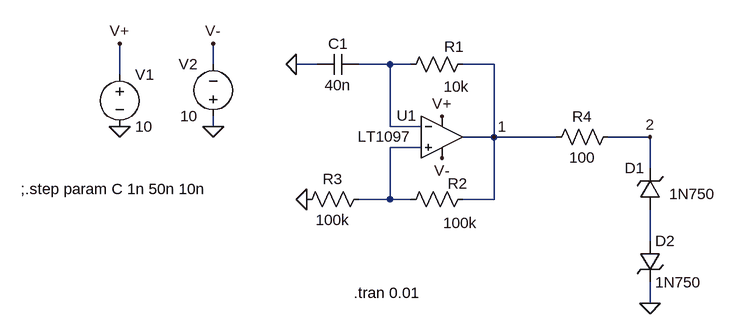
[diagram p0: schematic Ask1.asc]
Ask1.asc, the LTspice schematic file:
Version 4
SHEET 1 880 680
WIRE -48 -96 -48 -128
WIRE 112 -96 80 -96
WIRE 224 -96 176 -96
WIRE 256 -96 224 -96
WIRE 384 -96 336 -96
WIRE -192 -80 -192 -128
WIRE -48 0 -48 -16
WIRE 224 0 224 -96
WIRE 272 0 224 0
WIRE 384 16 384 -96
WIRE 384 16 336 16
WIRE 480 16 384 16
WIRE 624 16 560 16
WIRE 272 32 224 32
WIRE 624 64 624 16
WIRE 224 112 224 32
WIRE 224 112 176 112
WIRE 256 112 224 112
WIRE 384 112 384 16
WIRE 384 112 336 112
WIRE 624 176 624 128
WIRE 624 272 624 240
FLAG 80 -96 0
FLAG -192 0 0
FLAG -192 -128 V+
FLAG 304 -16 V+
FLAG -48 0 0
FLAG -48 -128 V-
FLAG 304 48 V-
FLAG 96 112 0
FLAG 384 16 1
FLAG 624 16 2
FLAG 624 272 0
SYMBOL cap 176 -112 R90
WINDOW 0 0 32 VBottom 2
WINDOW 3 32 32 VTop 2
SYMATTR InstName C1
SYMATTR Value 40n
SYMBOL res 352 -112 R90
WINDOW 0 4 29 VBottom 2
WINDOW 3 35 26 VTop 2
SYMATTR InstName R1
SYMATTR Value 10k
SYMBOL OpAmps\\LT1097 304 -48 R0
WINDOW 0 -70 31 Left 2
WINDOW 3 -130 63 Left 2
SYMATTR InstName U1
SYMBOL res 192 96 R90
WINDOW 0 0 56 VBottom 2
WINDOW 3 32 56 VTop 2
SYMATTR InstName R3
SYMATTR Value 100k
SYMBOL res 352 96 R90
WINDOW 0 7 24 VBottom 2
WINDOW 3 37 20 VTop 2
SYMATTR InstName R2
SYMATTR Value 100k
SYMBOL voltage -192 -96 R0
SYMATTR InstName V1
SYMATTR Value 10
SYMBOL voltage -48 0 R180
WINDOW 0 24 96 Left 2
WINDOW 3 24 16 Left 2
SYMATTR InstName V2
SYMATTR Value 10
SYMBOL res 576 0 R90
WINDOW 0 0 56 VBottom 2
WINDOW 3 32 56 VTop 2
SYMATTR InstName R4
SYMATTR Value 100
SYMBOL zener 640 128 R180
WINDOW 0 24 64 Left 2
WINDOW 3 -85 24 Left 2
SYMATTR InstName D1
SYMATTR Value 1N750
SYMBOL zener 608 176 R0
SYMATTR InstName D2
SYMATTR Value 1N750
TEXT 168 256 Left 2 !.tran 0.01
TEXT -344 96 Left 2 !;.step param C 1n 50n 10n

The netlist it stands for:
* Ask1.asc
C1 N001 0 40n
R1 1 N001 10k
XU1 N002 N001 V+ V- 1 LT1097  ; pins In+ In- V+ V- OUT
R3 N002 0 100k
R2 1 N002 100k
V1 V+ 0 10
V2 0 V- 10
R4 2 1 100
D1 N003 2 1N750
D2 N003 0 1N750
.model D D
.lib standard.dio
.tran 0.01
;.step param C 1n 50n 10n
.backanno
.end